# Altium schematic sheet PWR.SchDoc: RP2040 Power
size 420 x 297 mm; Engineer: Hardy Yu, Yuchen Lin, Nelson Mei; DocumentNumber: 2; Revision: A; SheetNumber: 2; SheetTotal: 3; Time: 2024-06-25
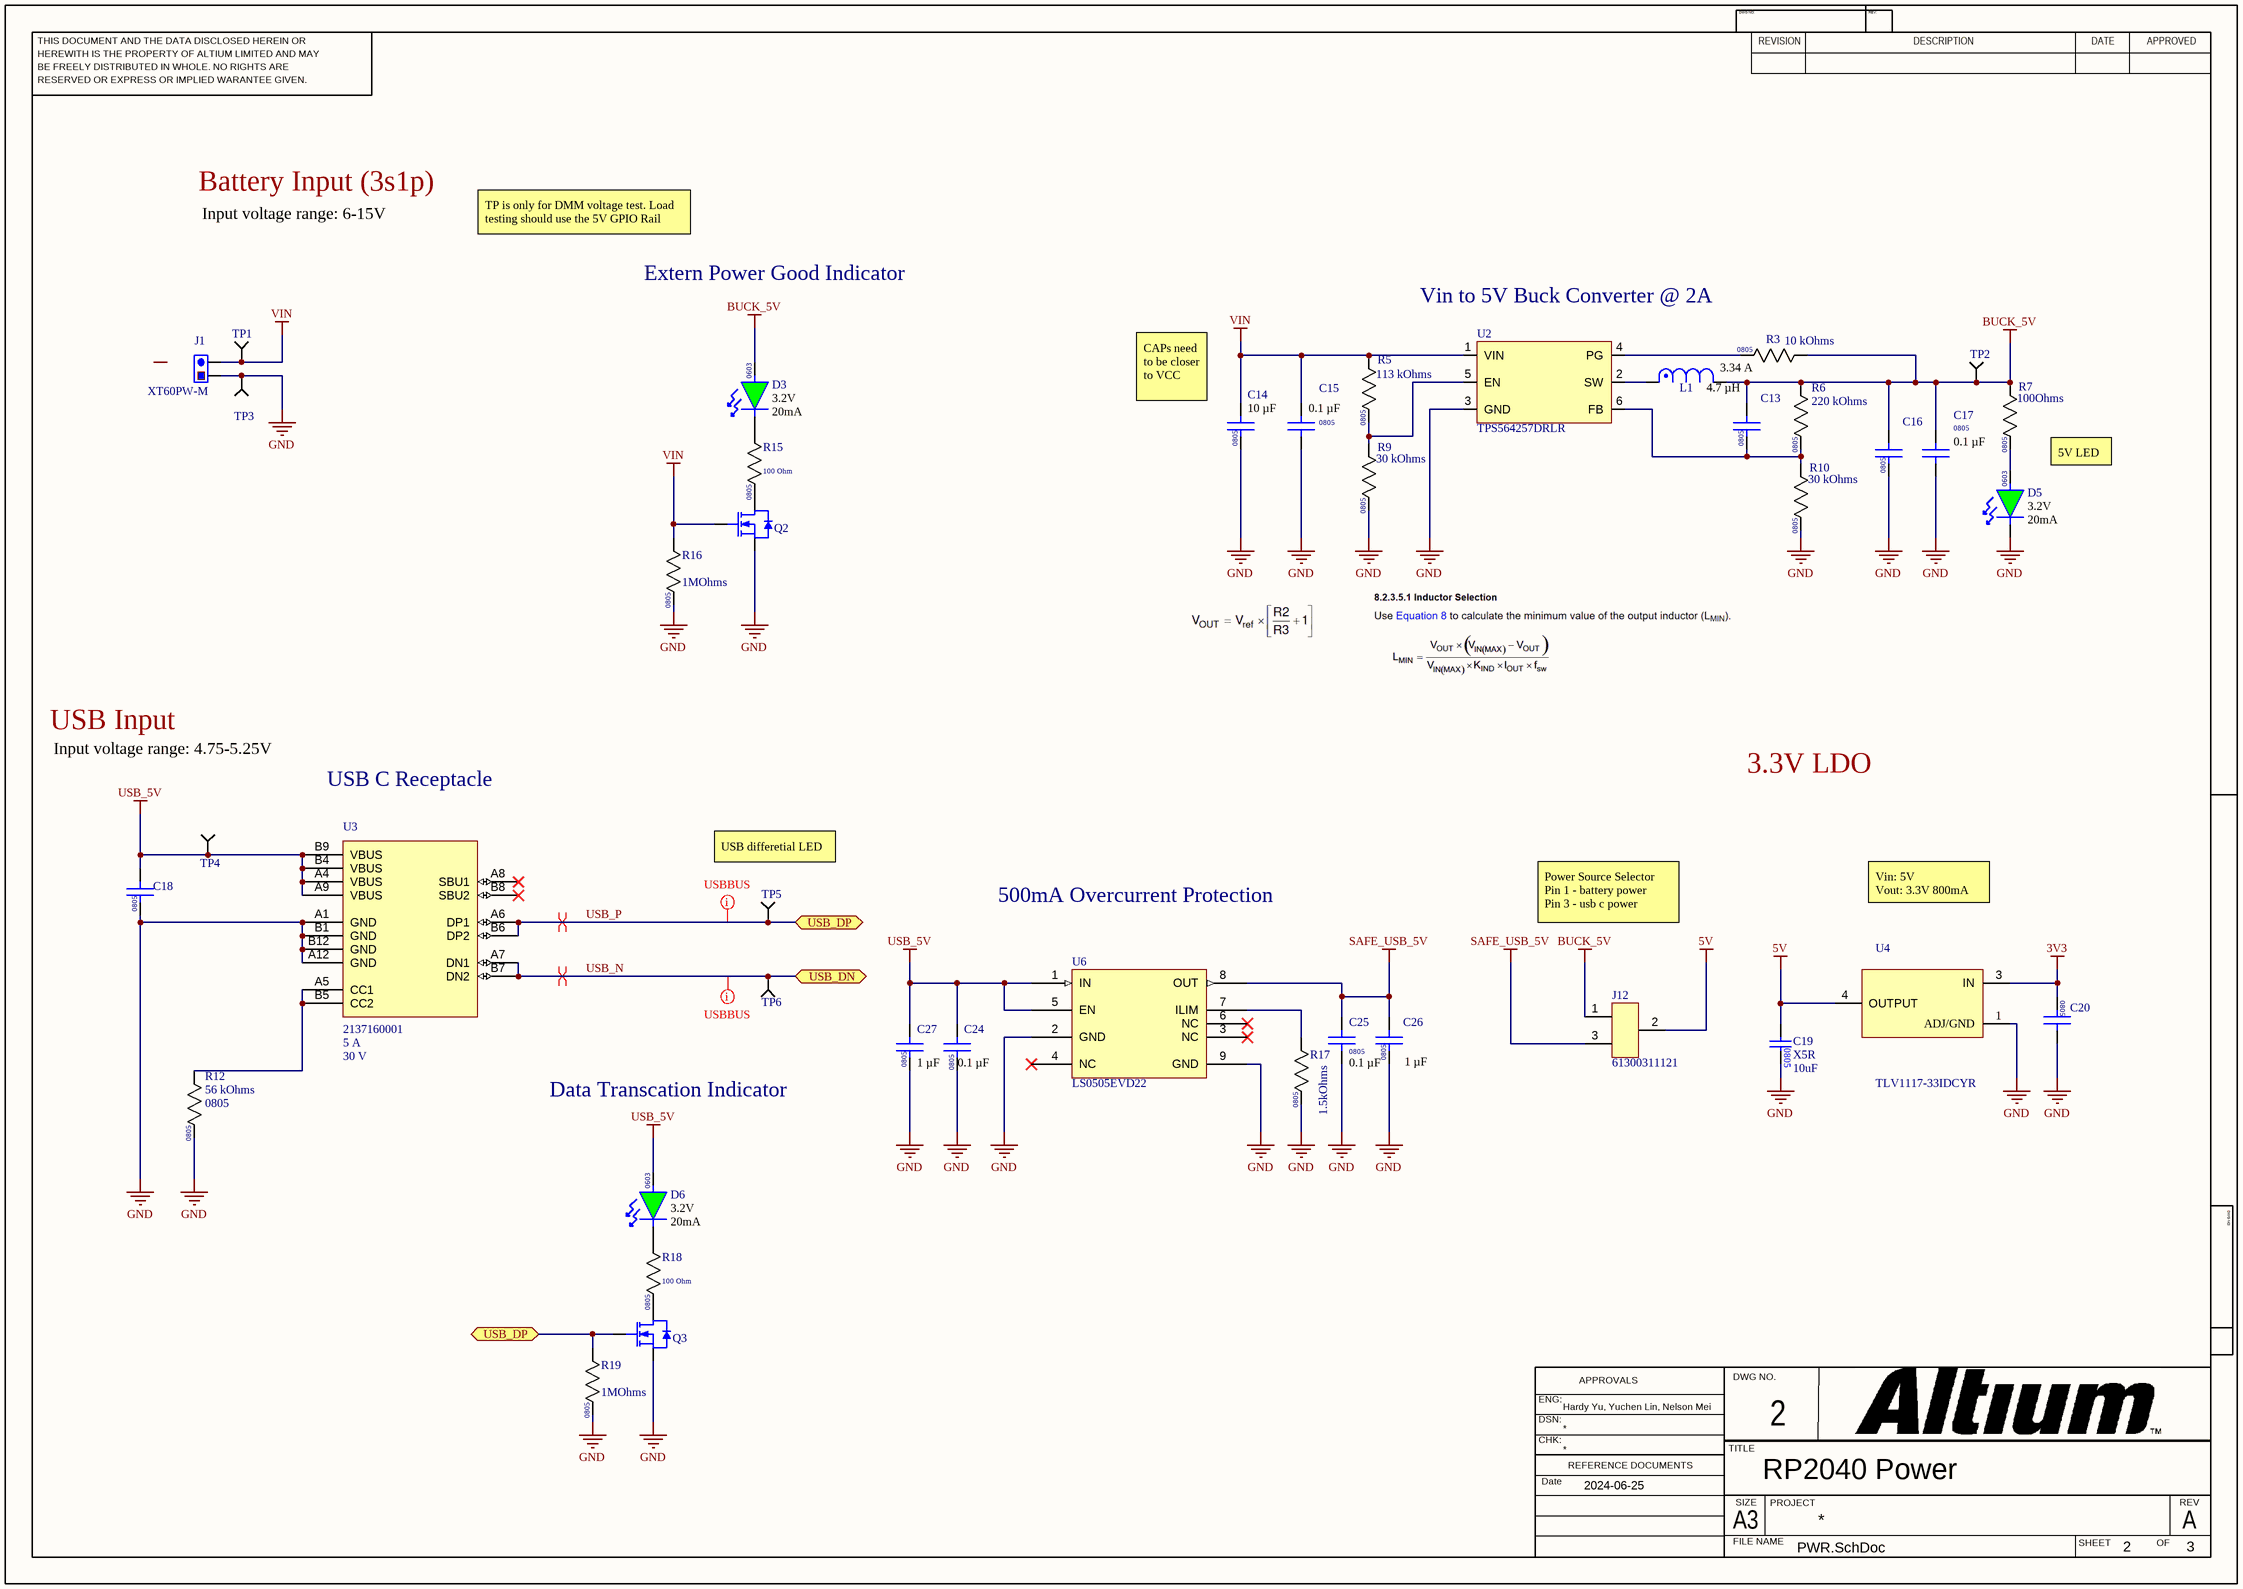
[diagram p0: PWR.SchDoc]

## Parts
C13  C0805C300J4HAC7800  [CAP_CL21_SAM]  (value not drawn)
C14  Capacitance: 10 µF  [CAP_CL21_SAM]  (hidden comment: CL21A106KOQNNNE)
C15  Capacitance: 0.1 µF  Package / Case: 0805  [CAP_CL21_SAM]  (hidden comment: C0805C104K4RAC7800)
C16  CL21A226MOCLRNC  [CAP_CL21_SAM]  (value not drawn)
C17  Capacitance: 0.1 µF  Package / Case: 0805  [CAP_CL21_SAM]  (hidden comment: C0805C104K4RAC7800)
C18  CC0805MRX7R9BB103  [CAP_CL21_SAM]  (value not drawn)
C19  value 10uF  Temperature Coefficient: X5R  [.CAP_0805-Footprint-1]  (hidden comment: CL21A106KOQNNNE)
C20  EMK325ABJ107MM-T  [CAP_EMK325AB_3P2X2P5_TAY-L]  (value not drawn)
C24  Capacitance: 0.1 µF  Package / Case: 0805  [CAP_CL21_SAM]  (hidden comment: C0805C104K4RAC7800)
C25  Capacitance: 0.1 µF  Package / Case: 0805  [CAP_CL21_SAM]  (hidden comment: C0805C104K4RAC7800)
C26  Capacitance: 1 µF  [CAP_CL21_SAM]  (hidden comment: 0805B105K250DC)
C27  Capacitance: 1 µF  [CAP_CL21_SAM]  (hidden comment: 0805B105K250DC)
D3  Voltage - Forward (Vf) (Typ): 3.2V  Current - Test: 20mA  [.LED_0603-Footprint-1]  (hidden comment: 150060GS75000)
D5  Voltage - Forward (Vf) (Typ): 3.2V  Current - Test: 20mA  [.LED_0603-Footprint-1]  (hidden comment: 150060GS75000)
D6  Voltage - Forward (Vf) (Typ): 3.2V  Current - Test: 20mA  [.LED_0603-Footprint-1]  (hidden comment: 150060GS75000)
J1  XT60PW-M  [AMASS_XT60PW-M]
J12  61300311121  [61300311121]
L1  RefDes: 4.7 µH  Current Rating (Amps): 3.34 A  [DR74]  (hidden comment: DR74-4R7-R)
Q2  DMG2302UKQ-7  [.SOT23-3]  (value not drawn)
Q3  DMG2302UKQ-7  [.SOT23-3]  (value not drawn)
R3  Resistance: 10 kOhms  [RESC1608X50N]  (hidden comment: ERJ-6GEYJ103V)
R5  Resistance: 113 kOhms  [RESC1608X50N]  (hidden comment: ERJ-6ENF1133V)
R6  Resistance: 220 kOhms  [RESC2012X65N]  (hidden comment: CRG0805F220K)
R7  Resistance: 100Ohms  [RESC2012X65N]  (hidden comment: RC0603FR-07100RL)
R9  Resistance: 30 kOhms  [RESC2012X65N]  (hidden comment: RMCF0805FT30K0)
R10  Resistance: 30 kOhms  [RESC2012X65N]  (hidden comment: RMCF0805FT30K0)
R12  Resistance: 56 kOhms  package: 0805  [RES_ERJ-6GEYJ563V]  (hidden comment: ERJ-6GEYJ563V)
R15  Resistence: 100 Ohm  [.RES_0805-Footprint-1]  (hidden comment: RMCF0805FT100R)
R16  Resistance: 1MOhms  [.RES_0805-Footprint-1]  (hidden comment: RC0805FR-071ML)
R17  Resistance: 1.5kOhms  [RESC2012X65N]  (hidden comment: RC0805FR-071K5L)
R18  Resistence: 100 Ohm  [.RES_0805-Footprint-1]  (hidden comment: RMCF0805FT100R)
R19  Resistance: 1MOhms  [.RES_0805-Footprint-1]  (hidden comment: RC0805FR-071ML)
TP1  5002  [KEYSTONE_5002]  (value not drawn)
TP2  5002  [KEYSTONE_5002]  (value not drawn)
TP3  5002  [KEYSTONE_5002]  (value not drawn)
TP4  5002  [KEYSTONE_5002]  (value not drawn)
TP5  5002  [KEYSTONE_5002]  (value not drawn)
TP6  5002  [KEYSTONE_5002]  (value not drawn)
U2  TPS564257DRLR  [TPS564242DRLR_TEX]
U3  2137160001  Rated Curent: 5 A  Rated Voltage: 30 V  [MOLEX_2137160001]
U4  TLV1117-33IDCYR  [DCY0004A_L]
U6  LS0505EVD22  [LS0505EVD22_LTF]

## Ports
USB_DN (bidir, see IO[1B], MCU[6B]), USB_DP (bidir, see IO[1A], MCU[6B], PWR[2D]), USB_DP (bidir, see IO[1A], MCU[6B], PWR[3C])

## Nets
3V3: C20.1 U4.3(IN)
5V: C19.1 J12.2 U4.4(OUTPUT)
BUCK_5V: C13.2 C16.2 C17.2 D3.2(+) J12.1 L1.2 R3.1 R6.1 R7.1 TP2.TP
GND: C14.1 C15.1 C16.1 C17.1 C18.1 C19.2 C20.2 C24.1 C25.1 C26.1 C27.1 D5.1(-) J1.1(POS) Q2.2(Source) Q3.2(Source) R9.2 R10.2 R12.2 R16.2 R17.2 R19.2 TP3.TP U2.3(GND) U3.A1(GND) U3.A12(GND) U3.B1(GND) U3.B12(GND) U4.1(ADJ/GND) U6.2(GND) U6.9(GND)
SAFE_USB_5V: C25.2 C26.2 J12.3 U6.8(OUT)
USB_5V: C18.2 C24.2 C27.2 D6.2(+) TP4.TP U3.A4(VBUS) U3.A9(VBUS) U3.B4(VBUS) U3.B9(VBUS) U6.1(IN) U6.5(EN)
VIN: C14.2 C15.2 J1.2(NEG) Q2.1(Gate) R5.1 R16.1 TP1.TP U2.1(VIN)
USB_N: TP6.TP U3.A7(DN1) U3.B7(DN2) ; port USB_DN
USB_P: Q3.1(Gate) R19.1 TP5.TP U3.A6(DP1) U3.B6(DP2) ; port USB_DP
NetC13_1: C13.1 R6.2 R10.1 U2.6(FB)
NetD3_1: D3.1(-) R15.1
NetD5_2: D5.2(+) R7.2
NetD6_1: D6.1(-) R18.1
NetL1_1: L1.1 U2.2(SW)
NetQ2_3: Q2.3(Drain) R15.2
NetQ3_3: Q3.3(Drain) R18.2
NetR3_2: R3.2 U2.4(PG)
NetR5_2: R5.2 R9.1 U2.5(EN)
NetR12_1: R12.1 U3.A5(CC1) U3.B5(CC2)
NetR17_1: R17.1 U6.7(ILIM)

Not connected (* = marked no-connect by the designer): U3 A8(SBU1)* B8(SBU2)*; U6 3(NC)* 4(NC)* 6(NC)*

## Layout directives
differential pair; differential pair class USB_BUS: USB_N, USB_P
mark named USBBUS: USB_N, USB_P

## Notes on the sheet
- Battery Input (3s1p)
- Input voltage range: 6-15V
- TP is only for DMM voltage test. Load testing should use the 5V GPIO Rail
- Extern Power Good Indicator
- Vin to 5V Buck Converter @ 2A
- (near C14) CAPs need to be closer to VCC
- 5V LED
- USB Input
- Input voltage range: 4.75-5.25V
- USB C Receptacle
- 3.3V LDO
- (near TP5) USB differetial LED
- 500mA Overcurrent Protection
- Power Source Selector
  Pin 1 - battery power
  Pin 3 - usb c power
- Vin: 5V
  Vout: 3.3V 800mA
- Data Transcation Indicator
- THIS DOCUMENT AND THE DATA DISCLOSED HEREIN OR
- HEREWITH IS THE PROPERTY OF ALTIUM LIMITED AND MAY
- DWG NO:
- REVISION
- REV:
- DESCRIPTION
- DATE
- APPROVED
- BE FREELY DISTRIBUTED IN WHOLE. NO RIGHTS ARE
- RESERVED OR EXPRESS OR IMPLIED WARANTEE GIVEN.
- ENG:
- APPROVALS
- DWG NO.
- DSN:
- CHK:
- REFERENCE DOCUMENTS
- TITLE
- Date
- A3
- FILE NAME
- SIZE
- PROJECT
- SHEET
- OF
- REV
- (in symbol 0805B105K250DC) 0805
- (in symbol 150060GS75000) 0603
- (in symbol C0805C300J4HAC7800) 0805
- (in symbol CC0805MRX7R9BB103) 0805
- (in symbol CL21A106KOQNNNE) 0805
- (in symbol CL21A226MOCLRNC) 0805
- (in symbol CRG0805F220K) 0805
- (in symbol EMK325ABJ107MM-T) 0805
- (in symbol ERJ-6ENF1133V) 0805
- (in symbol ERJ-6GEYJ103V) 0805
- (in symbol RC0603FR-07100RL) 0805
- (in symbol RC0805FR-071K5L) 0805
- (in symbol RC0805FR-071ML) 0805
- (in symbol RMCF0805FT30K0) 0805
- (in symbol RMCF0805FT100R) 0805

## Library data of the parts
C13 = C0805C300J4HAC7800: 30 pF ±5% 16V Ceramic Capacitor X8R 0805 (2012 Metric); Mfr_Name: KEMET; Voltage - Rated: 16V; ComponentLink1Description: Digikey; ComponentLink1URL: https://www.digikey.ca/en/products/detail/kemet/C0805C300J4HAC7800/7948369
C14 = CL21A106KOQNNNE: 10 µF ±10% 16V Ceramic Capacitor X5R 0805 (2012 Metric); Mfr_Name: Samsung; Voltage - Rated: 16V; ComponentLink1Description: Digikey; ComponentLink1URL: https://www.digikey.ca/en/products/detail/samsung-electro-mechanics/CL21A106KOQNNNE/3886754
C15 C17 C24 C25 = C0805C104K4RAC7800: 0.1 µF ±10% 16V Ceramic Capacitor X7R 0805 (2012 Metric); Mfr_Name: KEMET; Voltage - Rated: 16V; ComponentLink1Description: Digikey; ComponentLink1URL: https://www.digikey.ca/en/products/detail/kemet/C0805C104K4RAC7800/411166
C16 = CL21A226MOCLRNC: 22 µF ±20% 16V Ceramic Capacitor X5R 0805 (2012 Metric); Mfr_Name: Samsung Electro-Mechanics; Voltage - Rated: 16V; ComponentLink1Description: Digikey; ComponentLink1URL: https://www.digikey.ca/en/products/detail/kemet/C0805C100M4GAC7800/2211624
C18 = CC0805MRX7R9BB103: 10000 pF ±20% 50V Ceramic Capacitor X7R 0805 (2012 Metric); Mfr_Name: Yageo; Voltage: 50V; Tolerance: 20%
C19 = CMP-001-00016-4: CAP CER 10UF 16V X5R 0805; Package: 0805; Voltage: 16V; Capacitance: 10uF
C20 = EMK325ABJ107MM-T: 100 µF ±20% 16V Ceramic Capacitor X5R 1210 (3225 Metric); Mfr_Name: Taiyo Yuden; Tolerance: 20%; Voltage Rated: 16 V; Package: 1210
C26 C27 = 0805B105K250DC: CAP SMD,0805,X7R,1UF,10%,25V; Mfr_Name: Samsung; Voltage - Rated: 16V; ComponentLink1Description: Digikey; ComponentLink1URL: https://www.digikey.ca/en/products/detail/samsung-electro-mechanics/CL21A106KOQNNNE/3886754
D3 D5 D6 = 150060GS75000: Green 520nm LED Indication - Discrete 3.2V 0603 (1608 Metric); Mfr_Name: Wurth Electronics
J1 = XT60PW-M: Socket, DC supply, male, PIN: 2; MF: AMASS; Check_prices: https://www.snapeda.com/parts/XT60PW-M/AMASS/view-part/?ref=eda; SnapEDA_Link: https://www.snapeda.com/parts/XT60PW-M/AMASS/view-part/?ref=snap; Price: None; Availability: Not in stock; Package: Package; MP: XT60PW-M; Value: *
J12 = 61300311121: CONN HEADER VERT 3POS 2.54MM; Number of positions: 3; Connector Type: Header; Contact Type: Male Pin
L1 = DR74-4R7-R: 4.7 µH Shielded Drum Core, Wirewound Inductor 3.34 A 25.4mOhm Nonstandard; Mfr_Name: Eaton / Coiltronics; ComponentLink1Description: Digikey; ComponentLink1URL: https://www.digikey.ca/en/products/detail/eaton-electronics-division/DR74-4R7-R/667225
Q2 Q3 = CMP-013-00010-1: MOSFET N-CH 20V 2.8A SOT23 T&R 3; Rds(on): 90m; Vgs(th): 1V; Max Continuous Current Drain: 2.8A; Max Drain to Source Voltage: 20V
R3 = ERJ-6GEYJ103V: 10 kOhms ±5% 0.125W, 1/8W Chip Resistor 0805 (2012 Metric) Automotive AEC-Q200 Thick Film; Mfr_Name: Panasonic; Tolerance: ±5%; Power (Watts): 0.125W, 1/8W; ComponentLink1Description: Digikey; ComponentLink1URL: https://www.digikey.ca/en/products/detail/panasonic-electronic-components/ERJ-6GEYJ103V/83062
R5 = ERJ-6ENF1133V: 113 kOhms ±1% 0.125W, 1/8W Chip Resistor 0805 (2012 Metric) Automotive AEC-Q200 Thick Film; Mfr_Name: Panasonic; Tolerance: ±1%; Power (Watts): 0.125W, 1/8W; ComponentLink1Description: Digikey; ComponentLink1URL: https://www.digikey.ca/en/products/detail/panasonic-electronic-components/ERJ-6ENF1133V/111851
R6 = CRG0805F220K: 220 kOhms ±1% 0.125W, 1/8W Chip Resistor 0805 (2012 Metric) Thick Film; Mfr_Name: TE Connectivity Passive Product; Tolerance: ±1%; Power (Watts): 0.125W, 1/8W; ComponentLink1Description: Digikey; ComponentLink1URL: https://www.digikey.ca/en/products/detail/te-connectivity-passive-product/CRG0805F220K/2380869
R7 = RC0603FR-07100RL: 100 Ohms ±1% 0.1W, 1/10W Chip Resistor 0603 (1608 Metric) Moisture Resistant Thick Film; Mfr_Name: YAGEO; Tolerance: ±1%; Power (Watts): 0.1W, 1/10W; ComponentLink1Description: Digikey; ComponentLink1URL: https://www.digikey.ca/en/products/detail/stackpole-electronics-inc/RMCF0805FT30K0/1760543
R9 R10 = RMCF0805FT30K0: 30 kOhms ±1% 0.125W, 1/8W Chip Resistor 0805 (2012 Metric) Automotive AEC-Q200 Thick Film; Mfr_Name: Stackpole Electronics Inc; Tolerance: ±1%; Power (Watts): 0.125W, 1/8W; ComponentLink1Description: Digikey; ComponentLink1URL: https://www.digikey.ca/en/products/detail/stackpole-electronics-inc/RMCF0805FT30K0/1760543
R12 = ERJ-6GEYJ563V: 56 kOhms ±5% 0.125W, 1/8W Chip Resistor 0805 (2012 Metric) Automotive AEC-Q200 Thick Film; Mfr_Name: Panasonic; Tolerance: ±5%; Power (Watts): 0.125W, 1/8W; ComponentLink1Description: Digikey; ComponentLink1URL: https://www.digikey.ca/en/products/detail/panasonic-electronic-components/ERJ-6GEYJ563V/83098
R15 R18 = RMCF0805FT100R: RES 100 OHM 1% 1/8W 0805; Mfr_Name: Stackpole International
R16 R19 = RC0805FR-071ML: RES 1M OHM 1% 1/8W 0805; Power: 1/8W
R17 = RC0805FR-071K5L: 1.5 kOhms ±1% 0.125W, 1/8W Chip Resistor 0805 (2012 Metric) Moisture Resistant Thick Film; Mfr_Name: Stackpole Electronics Inc; Tolerance: ±1%; Power (Watts): 0.125W, 1/8W; ComponentLink1Description: Digikey; ComponentLink1URL: https://www.digikey.ca/en/products/detail/stackpole-electronics-inc/RMCF0805FT30K0/1760543
TP1-TP6 = 5002: Test Point Miniature THM H .300 Nylon 46 Insulated White PhosBronze/Silver | Keystone Electronics 5002; SnapEDA_Link: https://www.snapeda.com/parts/5002/Keystone+Electronics/view-part/?ref=snap; Package: NON STANDARD-1 Keystone; Value: *; MF: Keystone Electronics; MP: 5002; Check_prices: https://www.snapeda.com/parts/5002/Keystone+Electronics/view-part/?ref=eda; ComponentLink1Description: Digikey; ComponentLink1URL: https://www.digikey.ca/en/products/detail/keystone-electronics/5002/255328
U2 = TPS564257DRLR: Buck Switching Regulator IC Positive Adjustable 0.6V 1 Output 4A SOT-563, SOT-666; Mfr_Name: Texas Instruments; Voltage - Input (Max): 17V; Frequency - Switching: 600kHz; Type: Power Management; ComponentLink1Description: Digikey; ComponentLink1URL: https://www.digikey.ca/en/products/detail/texas-instruments/TPS564257DRLR/20415407?s=N4IgTCBcDaICoAUDKBWAbAFjCg7AEQCUAZEAXQF8g
U3 = 2137160001: CONN RCPT USB2.0 TYPE C 24POS RA; Mfr_Name: Molex Connector Corporation; Gender: Receptacle; RefDes: RefDes; Type: USB-C; Operating Temp: -30 ~ 85
U4 = TLV1117-33IDCYR: 800-mA, 15-V, linear voltage regulator, 3.3V fixoutput, Adjustable output; Mfr_Name: Texas Instruments; Vin Min: 2.7V; Iq: 1.7mA; Op temp: -40 ~ 125; Vin Max: 12V; TYPE: TYPE; RefDes: RefDes; Fixed output: 3.3V
U6 = LS0505EVD22: IC ELECTRONIC FUSE 10DFN; Mfr_Name: Littelfuse Inc; RefDes: RefDes; Type: Type